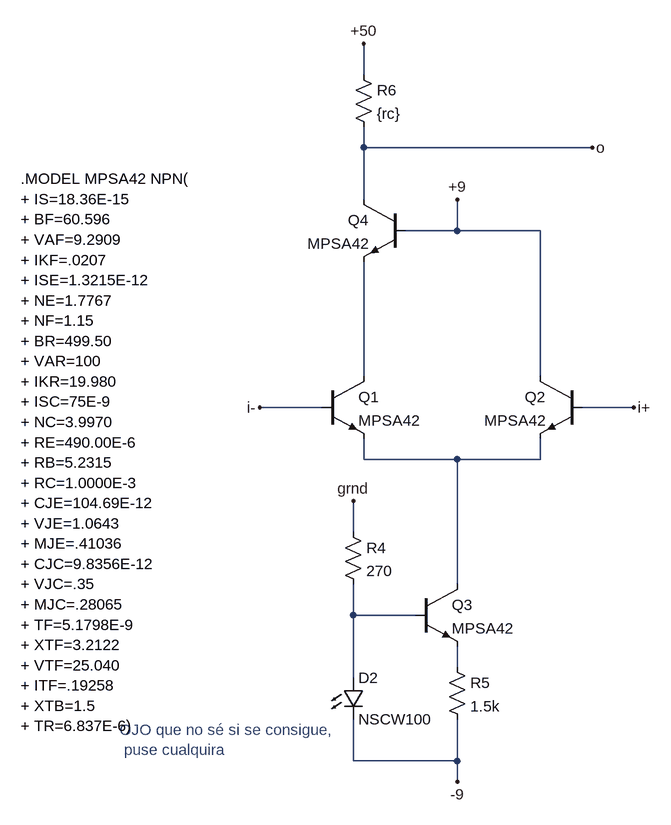
[diagram p0: schematic ss-par-cascode-npn.asc]
ss-par-cascode-npn.asc, the LTspice schematic file:
Version 4
SHEET 1 1328 980
WIRE -448 -304 -448 -352
WIRE -448 -192 -448 -224
WIRE -96 -192 -448 -192
WIRE -448 -112 -448 -192
WIRE -304 -64 -304 -112
WIRE -304 -64 -384 -64
WIRE -176 -64 -304 -64
WIRE -448 160 -448 -16
WIRE -176 160 -176 -64
WIRE -512 208 -608 208
WIRE -32 208 -112 208
WIRE -448 288 -448 256
WIRE -304 288 -448 288
WIRE -176 288 -176 256
WIRE -176 288 -304 288
WIRE -464 400 -464 352
WIRE -304 480 -304 288
WIRE -464 528 -464 480
WIRE -368 528 -464 528
WIRE -304 608 -304 576
WIRE -464 624 -464 528
WIRE -464 752 -464 688
WIRE -304 752 -304 688
WIRE -304 752 -464 752
WIRE -304 784 -304 752
FLAG -304 -112 +9
FLAG -96 -192 o
FLAG -32 208 i+
FLAG -608 208 i-
FLAG -304 784 -9
FLAG -448 -352 +50
FLAG -464 352 grnd
SYMBOL npn -368 480 R0
SYMATTR InstName Q3
SYMATTR Value MPSA42
SYMBOL npn -512 160 R0
SYMATTR InstName Q1
SYMATTR Value MPSA42
SYMBOL npn -112 160 M0
SYMATTR InstName Q2
SYMATTR Value MPSA42
SYMBOL res -480 384 R0
SYMATTR InstName R4
SYMATTR Value 270
SYMBOL res -320 592 R0
SYMATTR InstName R5
SYMATTR Value 1.5k
SYMBOL LED -480 624 R0
SYMATTR InstName D2
SYMATTR Value NSCW100
SYMBOL res -464 -320 R0
SYMATTR InstName R6
SYMATTR Value {rc}
SYMBOL npn -384 -112 M0
SYMATTR InstName Q4
SYMATTR Value MPSA42
TEXT -824 704 Left 2 ;OJO que no sé si se consigue,\n puse cualquira
TEXT -976 -144 Left 2 !.MODEL MPSA42 NPN(\n+ IS=18.36E-15\n+ BF=60.596\n+ VAF=9.2909\n+ IKF=.0207\n+ ISE=1.3215E-12\n+ NE=1.7767\n+ NF=1.15\n+ BR=499.50\n+ VAR=100\n+ IKR=19.980\n+ ISC=75E-9\n+ NC=3.9970\n+ RE=490.00E-6\n+ RB=5.2315\n+ RC=1.0000E-3\n+ CJE=104.69E-12\n+ VJE=1.0643\n+ MJE=.41036\n+ CJC=9.8356E-12\n+ VJC=.35\n+ MJC=.28065\n+ TF=5.1798E-9\n+ XTF=3.2122\n+ VTF=25.040\n+ ITF=.19258\n+ XTB=1.5\n+ TR=6.837E-6)

The netlist it stands for:
* ss-par-cascode-npn.asc
Q3 N002 N003 N004 0 MPSA42
Q1 N001 i- N002 0 MPSA42
Q2 +9 i+ N002 0 MPSA42
R4 grnd N003 270
R5 N004 -9 1.5k
D2 N003 -9 NSCW100
R6 +50 o {rc}
Q4 o +9 N001 0 MPSA42
.model D D
.lib standard.dio
.model NPN NPN
.model PNP PNP
.lib standard.bjt
* OJO que no sé si se consigue,
*  puse cualquira
.MODEL MPSA42 NPN(
+ IS=18.36E-15
+ BF=60.596
+ VAF=9.2909
+ IKF=.0207
+ ISE=1.3215E-12
+ NE=1.7767
+ NF=1.15
+ BR=499.50
+ VAR=100
+ IKR=19.980
+ ISC=75E-9
+ NC=3.9970
+ RE=490.00E-6
+ RB=5.2315
+ RC=1.0000E-3
+ CJE=104.69E-12
+ VJE=1.0643
+ MJE=.41036
+ CJC=9.8356E-12
+ VJC=.35
+ MJC=.28065
+ TF=5.1798E-9
+ XTF=3.2122
+ VTF=25.040
+ ITF=.19258
+ XTB=1.5
+ TR=6.837E-6)
.backanno
.end